# EAGLE design Adafruit DAC7578P Breakout (EAGLE 9.6.2)
COMPANY: ADAFRUIT INDUSTRIES; DRAWN: KTOWN; REV: A
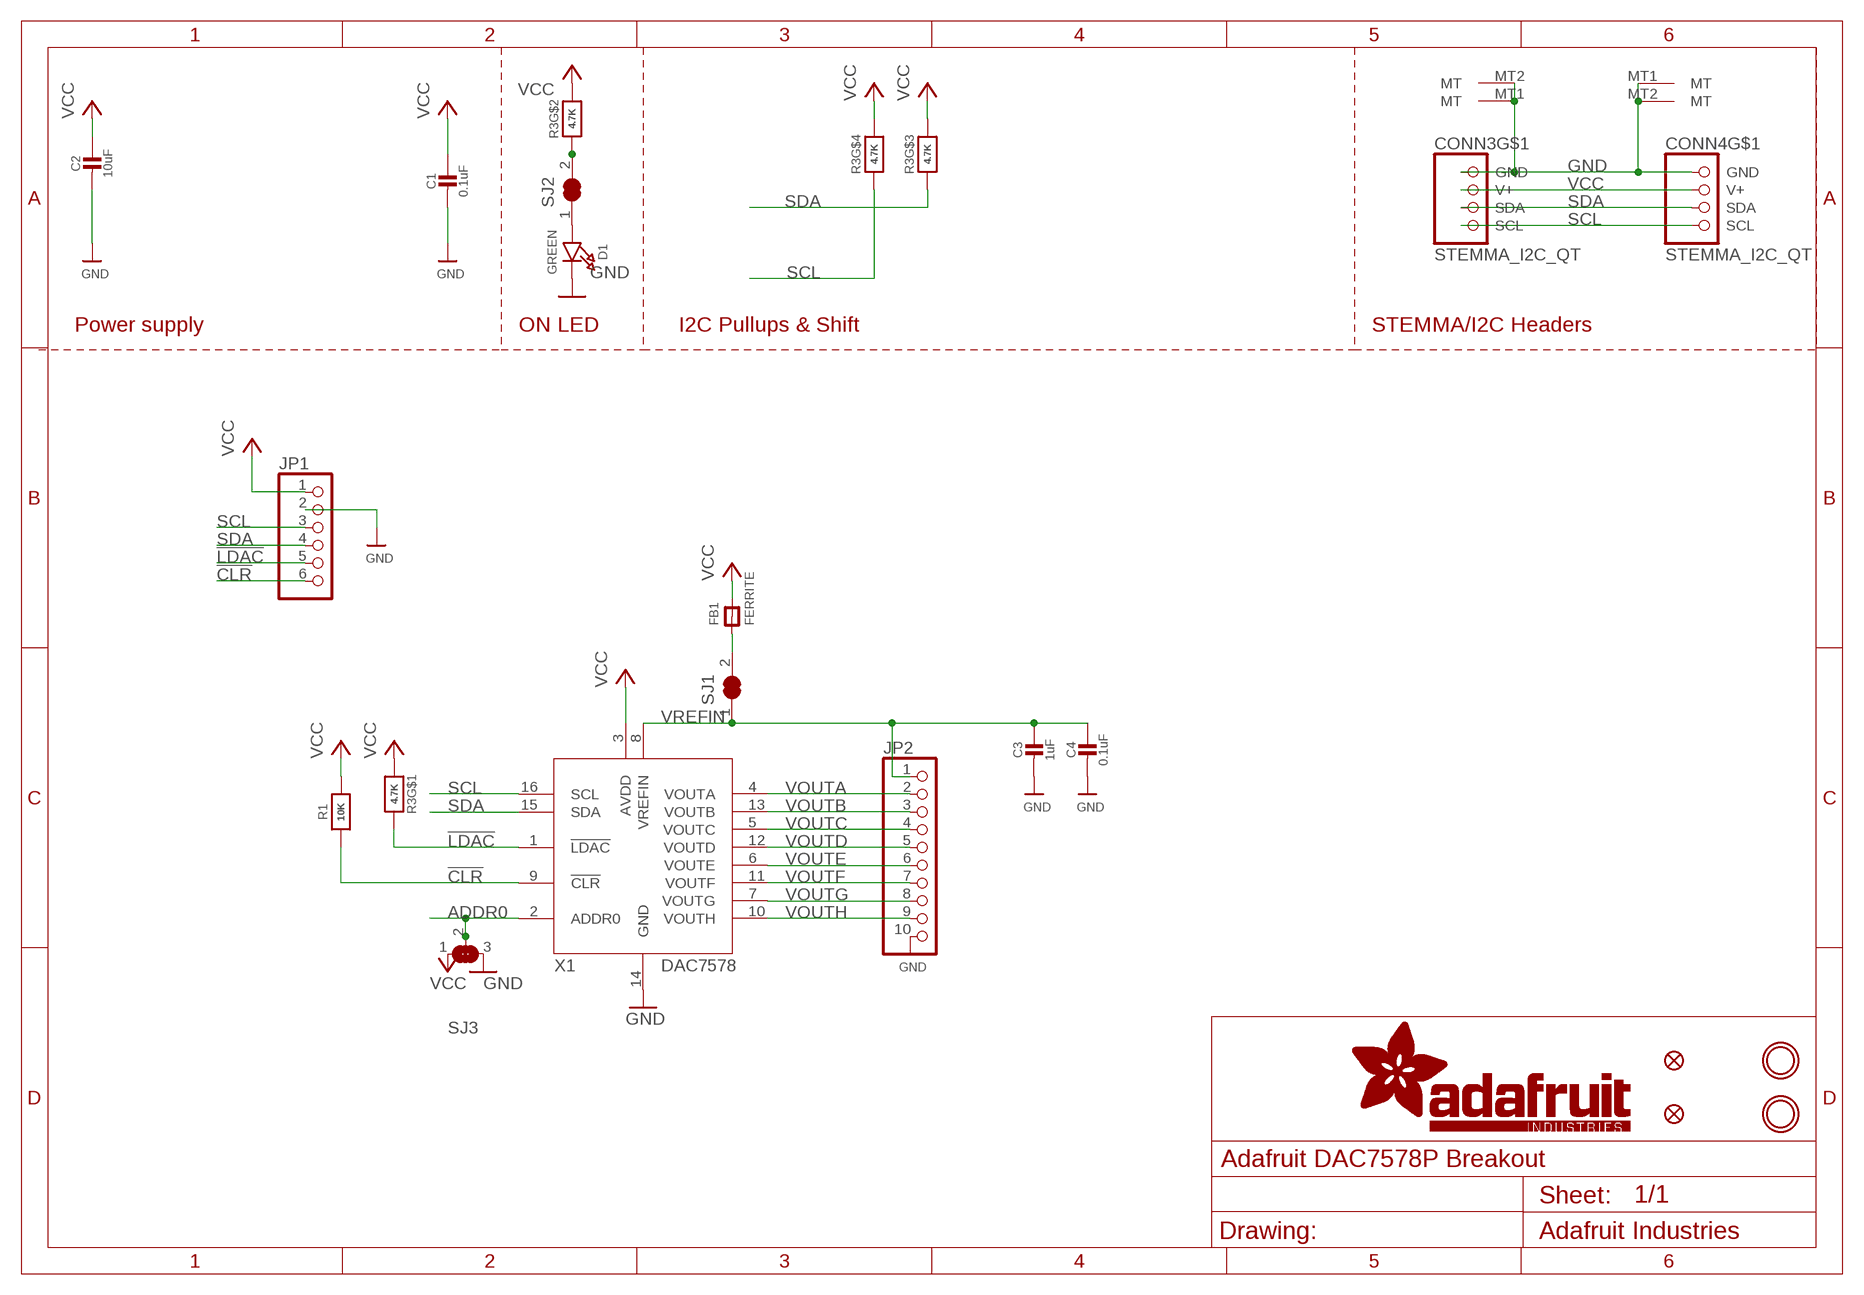
[diagram p0: schematic, sheet 1]

## Parts
C1  0.1uF  CAP_CERAMIC0603_NO  [0603-NO]
C2  10uF  CAP_CERAMIC0805-NOOUTLINE  [0805-NO]
C3  1uF  CAP_CERAMIC0603_NO  [0603-NO]
C4  0.1uF  CAP_CERAMIC0603_NO  [0603-NO]
CONN3  STEMMA_I2C_QT  [JST_SH4]
CONN4  STEMMA_I2C_QT  [JST_SH4]
D1  GREEN  LED0603_NOOUTLINE  [CHIPLED_0603_NOOUTLINE]
FB1  FERRITE  FERRITE-0603NO  [0603-NO]
FID3  FIDUCIAL_0.5MM  [FIDUCIAL_0.5MM]
FID4  FIDUCIAL_0.5MM  [FIDUCIAL_0.5MM]
JP1  HEADER-1X670MIL  [1X06_ROUND_70]
JP2  HEADER-1X1070MIL  [1X10_ROUND70]
R1  10K  RESISTOR_0603_NOOUT  [0603-NO]
R3  4.7K  RESISTOR_4PACK  [RESPACK_4X0603]
SJ1  SOLDERJUMPER_CLOSED  [SOLDERJUMPER_CLOSEDWIRE]
SJ2  SOLDERJUMPER_CLOSED  [SOLDERJUMPER_CLOSEDWIRE]
SJ3  SOLDERJUMPER_2WAY  [SOLDERJUMPER_2WAY_OPEN_NOPASTE]
U$19  MOUNTINGHOLE2.5  [MOUNTINGHOLE_2.5_PLATED]
U$21  MOUNTINGHOLE2.5  [MOUNTINGHOLE_2.5_PLATED]
X1  DAC7578PW  [TSSOP16]

## Nets
!CLR: JP1.6 R1.1 X1.9(!CLR)
!LDAC: JP1.5 R3.8 X1.1(!LDAC)
ADDR0: SJ3.2 X1.2(ADDR0)
GND [lowpower]: C1.2 C2.2 C3.2 C4.2 CONN3.1(GND) CONN3.MT1(MT) CONN3.MT2(MT) CONN4.1(GND) CONN4.MT1(MT) CONN4.MT2(MT) D1.C JP1.2 JP2.10 SJ3.3 X1.14(GND)
N$1: R3.2 SJ2.2
N$7: FB1.1 SJ1.2
N$8: D1.A SJ2.1
SCL: CONN3.4(SCL) CONN4.4(SCL) JP1.3 R3.4 X1.16(SCL)
SDA: CONN3.3(SDA) CONN4.3(SDA) JP1.4 R3.3 X1.15(SDA)
VCC [lowpower]: C1.1 C2.1 CONN3.2(V+) CONN4.2(V+) FB1.2 JP1.1 R1.2 R3.1 R3.5 R3.6 R3.7 SJ3.1 X1.3(AVDD)
VOUTA: JP2.2 X1.4(VOUTA)
VOUTB: JP2.3 X1.13(VOUTB)
VOUTC: JP2.4 X1.5(VOUTC)
VOUTD: JP2.5 X1.12(VOUTD)
VOUTE: JP2.6 X1.6(VOUTE)
VOUTF: JP2.7 X1.11(VOUTF)
VOUTG: JP2.8 X1.7(VOUTG)
VOUTH: JP2.9 X1.10(VOUTH)
VREFIN: C3.1 C4.1 JP2.1 SJ1.1 X1.8(VREFIN)

## Notes on the sheet
- Power supply | ON LED | I2C Pullups & Shift | STEMMA/I2C Headers

## Library data of the parts
C1-C4 = microbuilder:CAP_CERAMIC: Ceramic Capacitors For new designs, use the packages preceded by an '_' character since they are more reliable: The following footprints should be used on most boards: _0402 - Standard footprint for regular board layouts _0603 - Standard footprint for regular board layouts _0805 - Standard footprint for regular board layouts _1206 - Standard footprint for regular board layouts For extremely tight-pitch boards where space is at a premium, the following 'micro-pitch' footprints can be used (smaller pads, no silkscreen outline, etc.): _0402MP - Micro-pitch footprint for very dense/compact boards _0603MP - Micro-pitch footprint for very dense/compact boards _0805MP - Micro-pitch footprint for very dense/compact boards _1206MP - Micro-pitch footprint for very dense/compact boards
CONN3 CONN4 = adafruit_electromech:STEMMA_I2C; LCSC: C2845363
D1 = microbuilder:LED: LED 0603 - 0603 Surface Mount Package 2mA: Green LED - Low Power (3.9mcd, 2ma, 1.7Vf) - Digikey: 475-2709-2-ND Orange LED - Low Power (9.8mcd, 2ma, 1.8Vf) - Digikey: 475-1194-2-ND Red LED - Low Power (5mcd, 2ma, 1.8Vf) - Digikey: 475-1195-2-ND Yellow LED - Low Power (7mcd, 2ma, 1.8Vf) - Digikey: 475-1196-2-ND 5mA: Blue LED - Low Power (17mcd, 5ma, 2.9Vf) - Digikey: LNJ937W8CRACT-ND 0805 - 0805 Surface Mount Package 2mA: Red LED (8.8mcd, 2mA, 1.8Vf, Clear) - Low Power [Digikey: 475-2510-1-ND] Green LED (5mcd, 2mA, 1.8Vf, Clear) - Low Power [Digikey: 475-2730-1-ND] Yellow LED (11.3mcd, 2mA, 1.8Vf, Clear) - Low Power [Digikey: 475-2555-1-ND] 20mA: Red LED (104mcd, 20mA, Diffused) - LS R976 [Digikey: 475-1278-6-ND] Red LED (12mcd, 20mA, 2.0Vf, Clear) - APT2012EC [Digikey: 754-1128-1-ND] Green LED (15mcd, 20mA, 2.2Vf, Clear) - APT2012GC [Digikey: 754-1131-1-ND] Orange LED (160mcd, 20mA, 2.1Vf, Clear) - APT2012SECK [Digikey: 754-1130-1-ND] 1206 - 1206 Surface Mount Package Green LED (26mcd, 20mA, Diffused) - LG N971 [Digikey: 475-1407-6-ND] Red LED (15mcd, 20mA, Diffused) - LH N974 [Digikey: 475-1416-6-ND] Cree - Cree High-Power Surface Mount LEDs XPEBWT-L1-0000-00D50 - White 111lm 350mA 2.9Vf 6200K 110° XTEAWT-00-0000-00000LEE3 - White 114lm 350mA 2.85Vf 5000K 115° Everlight - Everlight 45-21 Series Surface Mount LEDs 45-21/QK2C-B2832AC2CB2/2T - Warm White 2000mcd 20mA 3.25Vf 3050K 120° 45-21/LK2C-B38452C4CB2/2T - Nuetral White 2000mcd 20mA 3.25Vf 4150K 120° 45-21/LK2C-B50634C6CB2/2T - Cold White 2200mcd 20mA 3.25Vf 5650K 120° PLCC2 Reverse Mount LS T77K-J1L2-1-0-2-R18-Z - Red 11.25mcd 2mA 1.8Vf 630nm 120° LO T77K-L1M2-24-Z - Orange 19.6mcd 2mA 1.8Vf 606nm 120° LY T77K-K2M1-26-Z - Yellow 15.7mcd 2mA 1.8Vf 587nm 120°; ROT: 270
FB1 = microbuilder:FERRITE: Ferrite Bead 0603 MMZ1608B121C - 120 Ohm @ 100MHz, 600mA, 0.15 Ohm DC Resistance - Digikey: 445-2164-1-ND BK1608HW121-T - 120 Ohm, 600mA Ferrite Chip - Digikey: 587-1876-2-ND 0805 HZ0805B272R-10 - 2.7K Ohm @ 100MHz, 200mA, 0.8 Ohm DC Resistance - Digikey: 240-2504-1-ND (see also Murata BLM21BD272SN1L) MMZ2012Y152B - 1.5K Ohm @ 100MHz, 500mA, 0.4 Ohm DC Resistance - Digikey: 445-1560-1-ND - Mainly for high frequency (80-400MHz) MMZ2012R102A - 1K Ohm @ 100MHz, 500mA, 0.3 Ohm DC Resistance - Digikey: 445-1555-2-ND - More general purpose (10-200MHz)
FID3 FID4 = microbuilder:FIDUCIAL: Fiducial Alignment Points Various fiducial points for machine vision alignment.
JP1 = microbuilder:HEADER-1X6: PIN HEADER
JP2 = microbuilder:HEADER-1X10: PIN HEADER
R1 = microbuilder:RESISTOR: Resistors For new designs, use the packages preceded by an '_' character since they are more reliable: The following footprints should be used on most boards: _0402 - Standard footprint for regular board layouts _0603 - Standard footprint for regular board layouts _0805 - Standard footprint for regular board layouts _1206 - Standard footprint for regular board layouts For extremely tight-pitch boards where space is at a premium, the following 'micro-pitch' footprints can be used (smaller pads, no silkscreen outline, etc.): _0402MP - Micro-pitch footprint for very dense/compact boards _0603MP - Micro-pitch footprint for very dense/compact boards _0805MP - Micro-pitch footprint for very dense/compact boards _1206MP - Micro-pitch footprint for very dense/compact boards
R3 = microbuilder:RESISTOR_4PACK: Resistor Packs (4 resistors) 4 x 0603 10K 1/16W - Digikey: YC164J-10KCT-ND
SJ1 SJ2 = microbuilder:SOLDERJUMPER_CLOSED: Solder Jumper - Closed These solder jumpers are closed by default CLOSEDWIRE - 10 mil trace between pads that can be cut and resoldered later CLOSEDPERM - 63 mil trace between pads for a permanent connection (used to 'bridge' two signals, a shameless hack for Eagle). Can double as a test point as well (no cream layer)
SJ3 = microbuilder:SOLDERJUMPER_2WAY: 2-Way Solder Jumper
U$19 U$21 = adafruit_electromech:MOUNTINGHOLE: Mounting Hole For #2 screws (0.086"/2.18mm width, 0.094"/2.4mm hole) use 2.5mm; BOM: EXCLUDE
X1 = microbuilder:DAC7578PW

## Net classes
1 highpower: width 0.406 mm, drill 0.483 mm
2 lowpower: width 0.305 mm, drill 0.483 mm

## Board
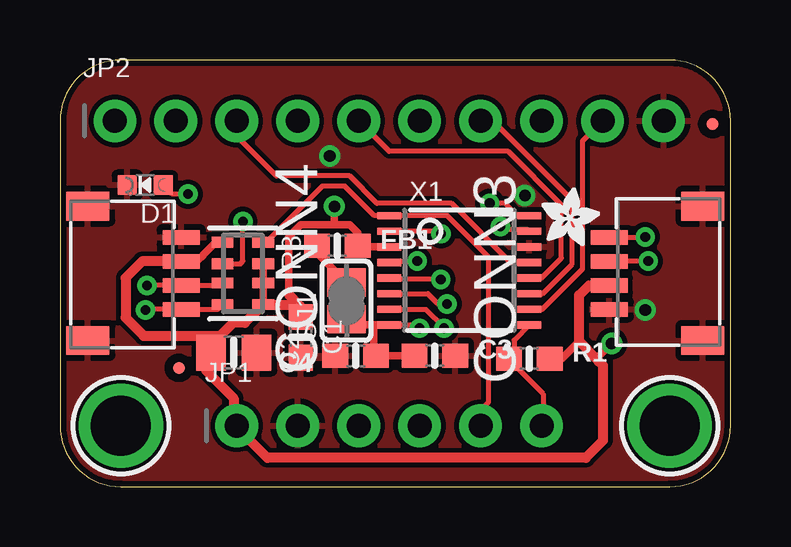
[diagram p1: board, top side]
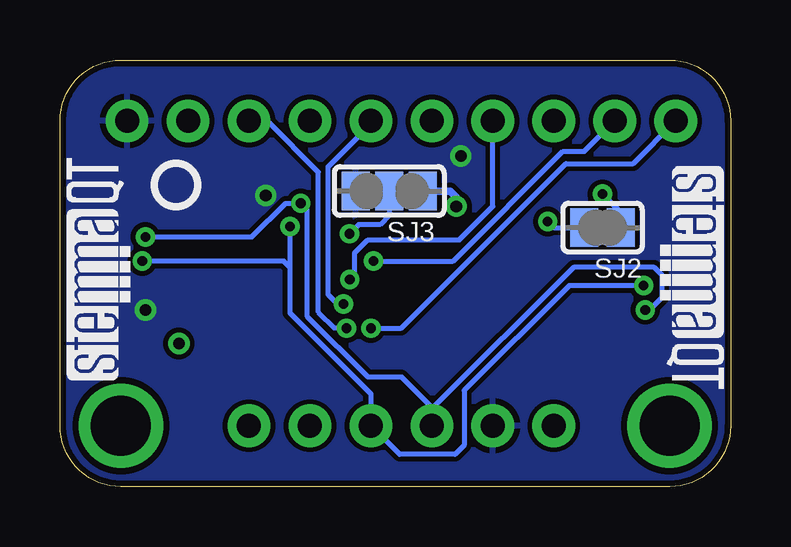
[diagram p2: board, bottom side, seen from below]

Size 27.94 x 17.78 mm. Coordinates in mm from the lower left corner, seen from the top.
Outline: 0,15.24 0,2.54 arc90 2.54,0 25.4,0 arc90 27.94,2.54 27.94,15.24 arc90 25.4,17.78 2.54,17.78 arc90 0,15.24
Copper layers (1*16): Top 0.035mm / dielectric 1.5mm / Bottom 0.035mm
Design rules "adafruit *": minimum track width 8mil, minimum drill 15.5mil, track to track 8mil, track to pad 8mil, pad to pad 8mil, via to via 8mil, smd to smd 8mil, copper to edge 10mil, drill to drill 8mil, minimum pad ring 10mil, minimum via ring 8mil, stop-mask expansion 2mil, vias tented up to drill 20mil, thermal gap 10mil

### Footprints (pad centres in the part's own frame; a part is rotated, then mirrored left to right if it is on the bottom)
0603-NO = smd 1.075 x 1: 1 -0.85,0; 2 0.85,0
0805-NO = smd 1.24 x 1.5: 1 -0.95,0; 2 0.95,0
JST_SH4 = smd 0.6 x 1.55: 1 -1.5,2.006; 2 -0.5,2.006; 3 0.5,2.006; 4 1.5,2.006 | smd 1.2 x 1.8: MT1 -2.8,-1.894; MT2 2.8,-1.894
CHIPLED_0603_NOOUTLINE = smd 0.8 x 0.8: A 0,-0.75; C 0,0.75
FIDUCIAL_0.5MM = smd 0.5 x 0.5: 1 0,0
1X06_ROUND_70 = drill 1 pad 1.778: 1 -6.35,0; 2 -3.81,0; 3 -1.27,0; 4 1.27,0; 5 3.81,0; 6 6.35,0
1X10_ROUND70 = drill 1 pad 1.778: 1 -11.43,0; 2 -8.89,0; 3 -6.35,0; 4 -3.81,0; 5 -1.27,0; 6 1.27,0; 7 3.81,0; 8 6.35,0; 9 8.89,0; 10 11.43,0
RESPACK_4X0603 = smd 0.45 x 0.9: 1 -1.3,-0.85; 2 -0.4,-0.85; 3 0.4,-0.85; 4 1.3,-0.85; 5 1.3,0.85; 6 0.4,0.85; 7 -0.4,0.85; 8 -1.3,0.85
SOLDERJUMPER_CLOSEDWIRE = smd 1.168 x 1.6: 1 -0.762,0; 2 0.762,0 | smd 0.635 x 0.203: WIRE 0,0
SOLDERJUMPER_2WAY_OPEN_NOPASTE = smd 1.168 x 1.6: 1 -1.397,0; 2 0,0; 3 1.397,0
MOUNTINGHOLE_2.5_PLATED = drill 2.5 pad 3.2: P$1 0,0
TSSOP16 = smd 0.305 x 0.991: 1 -2.275,-2.918; 2 -1.625,-2.918; 3 -0.975,-2.918; 4 -0.325,-2.918; 5 0.325,-2.918; 6 0.975,-2.918; 7 1.625,-2.918; 8 2.275,-2.918; 9 2.275,2.918; 10 1.625,2.918; 11 0.975,2.918; 12 0.325,2.918; 13 -0.325,2.918; 14 -0.975,2.918; 15 -1.625,2.918; 16 -2.275,2.918

### Placement (x,y rotation side)
C1  10.03,6.22 270 top
C2  7.24,5.59 0 top
C3  15.62,5.46 0 top
C4  12.32,5.46 180 top
CONN3  24.89,8.89 90 top
CONN4  3.05,8.89 270 top
D1  3.56,12.57 90 top
FB1  11.56,10.03 0 top
FID3  4.95,4.95 0 top
FID4  27.18,15.11 0 top
JP1  13.72,2.54 0 top
JP2  13.72,15.24 0 top
PLABEL0  [PLABEL0]  7.37,0.89 0 top
PLABEL1  [PLABEL1]  9.91,4.19 0 top
PLABEL2  [PLABEL2]  12.45,0.89 0 top
PLABEL3  [PLABEL3]  14.99,4.19 0 top
PLABEL4  [PLABEL4]  17.53,0.89 0 top
PLABEL5  [PLABEL5]  10.16,13.08 0 top
PLABEL6  [PLABEL6]  21.84,13.08 0 top
PLABEL7  [PLABEL7]  0.38,12.45 0 top
PLABEL8  [PLABEL8]  25.15,16.89 0 top
PLABEL9  [PLABEL9]  2.41,16.89 0 top
PLABEL10  [PLABEL10]  4.83,16.89 0 top
PLABEL11  [PLABEL11]  7.37,16.89 0 top
PLABEL12  [PLABEL12]  9.91,16.89 0 top
PLABEL13  [PLABEL13]  12.45,16.89 0 top
PLABEL14  [PLABEL14]  14.99,16.89 0 top
PLABEL15  [PLABEL15]  17.53,16.89 0 top
PLABEL16  [PLABEL16]  20.07,16.89 0 top
PLABEL17  [PLABEL17]  22.61,16.89 0 top
PLABEL18  [PLABEL18]  20.07,4.19 0 top
PLABEL19  [PLABEL19]  9.91,8.64 90 top
PLABEL20  [PLABEL20]  13.97,9.78 0 bottom
PLABEL21  [PLABEL21]  13.84,7.87 0 bottom
PLABEL22  [PLABEL22]  12.57,0.89 0 bottom
PLABEL23  [PLABEL23]  13.21,5.08 0 bottom
PLABEL24  [PLABEL24]  10.16,12.7 0 bottom
PLABEL25  [PLABEL25]  5.33,12.83 0 bottom
R1  19.56,5.33 0 top
R3  7.62,8.89 270 top
SJ1  11.94,7.75 90 top
SJ2  5.33,10.79 180 bottom
SJ3  14.22,12.32 180 bottom
U$4  [ADAFRUIT_2.5MM]  20.07,10.03 0 top
U$19  2.54,2.54 0 top
U$21  25.4,2.54 0 top
U$25  [PCBFEAT-REV-040]  23.11,12.57 0 bottom
U$30  [STEMMAQT]  25.02,4.45 90 bottom
U$31  [STEMMAQT]  2.92,13.34 270 bottom
X1  16.64,9.02 270 top

### Tracks (layer width: path | path; a pad name or v marks a point on that pad's centre or on a via)
!CLR
  Top 0.203: X1.9 18.92,6.11 18.92,5.33 18.92,5.08 20.13,3.87 20.13,2.6 JP1.6
  Top 0.305: R1.1 18.92,5.33
!LDAC
  Top 0.203: R3.8 8.6,10.19 10.93,12.52 11.87,12.52 13.1,11.29 X1.1 16.14,11.29 17.84,9.59 17.84,3.49 17.53,3.17 JP1.5
ADDR0  (via drill 0.4)
  Top 0.203: v15.88,10.54 15.77,10.64 X1.2
  Bottom 0.203: SJ3.2 14.22,11.3 14.61,10.92 15.49,10.92 v15.88,10.54
GND  (via drill 0.48)
  other vias: 24.38,7.37 19.37,12.13 11.24,13.78
  pour Top: 0,17.78 27.94,17.78 27.94,0 0,0
  pour Bottom: 0,17.78 27.94,17.78 27.94,0 0,0
N$1  (via drill 0.4)
  Top 0.203: R3.2 7.51,9.29 7.62,9.4 v7.62,11.05
  Bottom 0.203: v7.62,11.05 7.37,10.79 SJ2.2
N$7
  Top 0.305: SJ1.2 10.71,9.74 FB1.1
N$8  (via drill 0.4)
  Top 0.203: v5.33,12.19 4.69,12.19 D1.A
  Bottom 0.203: SJ2.1 4.57,11.43 v5.33,12.19
SCL  (via drill 0.4)
  Top 0.203: R3.4 6.57,7.39 CONN4.4 3.58,7.39 v3.56,7.37 | X1.16 19.06,11.29 18.54,11.81 v17.91,11.81 | CONN3.4 24.37,10.39 v24.38,10.41
  Bottom 0.203: v24.38,10.41 19.95,10.41 18.54,11.81 v17.91,11.81 17.65,11.56 17.65,7.11 15.11,4.57 13.72,4.57 12.45,3.3 JP1.3 12.45,3.24 6.54,9.14 3.17,9.14 2.86,8.83 2.86,7.87 3.37,7.37 v3.56,7.37
SDA  (via drill 0.4)
  Top 0.203: R3.3 6.67,8.39 CONN4.3 v3.63,8.39 v3.62,8.38 | X1.15 19.49,10.71 18.49,10.71 v18.36,10.84 | v24.51,9.4 v24.5,9.39 CONN3.3
  Bottom 0.203: v18.36,10.84 18.36,9.14 | 18.36,9.14 18.36,7.25 14.99,3.87 JP1.4 13.79,1.35 11.48,1.35 11.1,1.73 11.1,4.01 6.73,8.38 v3.62,8.38 | 18.36,9.14 18.61,9.4 v24.51,9.4
VCC  (via drill 0.48)
  Top 0.305: 9.55,7.97 9.53,8 9.53,10.41 10.03,10.92 11.43,10.92 | 11.43,10.92 12.06,10.92 12.41,10.58 FB1.2 12.45,9.99 X1.3 | R3.5 R3.6 R3.7 | v22.99,5.97 22.42,5.4 22.42,5.27 | R3.1 6.49,10.19 5.96,9.66 5.96,9.65 5.71,9.39 CONN4.2 | R1.2 20.91,5.33 21.63,6.05 | 11.43,10.92 v11.43,11.68
  Top 0.406: 6.67,6.29 6.29,5.91 C2.1 6.1,5.39 6.1,4.83 7.24,3.68 7.24,2.6 7.37,2.48 | 6.67,6.29 7.21,6.83 7.71,6.83 R3.5 9.94,7.59 | C1.1 10.03,7.49 9.94,7.59 | 9.94,7.59 9.55,7.97 | CONN3.2 22.04,8.39 21.63,7.98 21.63,6.05 22.42,5.27 22.63,5.05 22.63,1.93 21.91,1.21 8.64,1.21 7.37,2.48 | CONN4.2 3.42,9.39 2.73,8.7 2.73,7.05 3.49,6.29 6.67,6.29 | 7.37,2.48 JP1.1
  Bottom 0.305: v11.43,11.68 11.43,12.06 11.68,12.32 SJ3.1
VOUTA  (via drill 0.4)
  Top 0.203: X1.4 13.78,9.4 v14.88,9.4
  Bottom 0.203: JP2.2 6.1,13.97 6.99,13.97 11.55,9.4 v14.88,9.4
VOUTB
  Top 0.203: X1.13 18.79,9.34 16.32,11.81 13.21,11.81 12.06,12.95 9.02,12.95 7.37,14.61 JP2.3
VOUTC  (via drill 0.4)
  Top 0.203: X1.5 13.78,8.64 v15.87,8.64
  Bottom 0.203: v15.87,8.64 15.68,8.83 15.68,9.72 15.11,10.29 11.3,10.29 9.91,11.68 JP2.4
VOUTD
  Top 0.203: X1.12 20.06,8.69 20.89,9.53 20.89,11.75 18.67,13.97 13.72,13.97 JP2.5
VOUTE  (via drill 0.4)
  Top 0.203: X1.6 15.33,8.04 15.75,7.62 v16.13,7.62
  Bottom 0.203: v16.13,7.62 16.38,7.62 16.76,8 16.76,13.34 14.99,15.11 JP2.6
VOUTF
  Top 0.203: X1.11 20.11,8.04 21.34,9.27 21.34,11.94 18.03,15.24 JP2.7
VOUTG  (via drill 0.4)
  Top 0.203: X1.7 15.23,7.39 16,6.62 v16,6.6
  Bottom 0.203: JP2.8 19.3,15.24 17.17,13.11 17.17,7.28 16.5,6.6 v16,6.6
VOUTH
  Top 0.203: X1.10 20.09,7.39 21.78,9.08 21.78,14.41 JP2.9
VREFIN  (via drill 0.4)
  Top 0.203: X1.8 14.85,6.74 v14.99,6.6
  Top 0.305: X1.8 13.08,6.74 | 13.08,6.74 12.18,6.74 SJ1.1 | 13.08,6.74 13.08,5.55 C4.1 C3.1
  Bottom 0.203: v14.99,6.6 13.72,6.6 6.86,13.46 4.06,13.46 JP2.1

### Text on the board
Pinguin_tBackup: VRf | 0 | 1 | 2 | 3 | 4 | 5 | 6 | 7 | GND | DAC7578 | 8x12bit I2C DAC | on | Vrf | GND | SDA | CLR | VCC | SCL | LDAC
Pinguin_bBackup: LED | AD0 | DAC7578 | I2C Octal 12bit DAC | Default I2C Addr 0x4C / Broadcast Address 0x47 | VLogic/Vcc: 3-5VDC